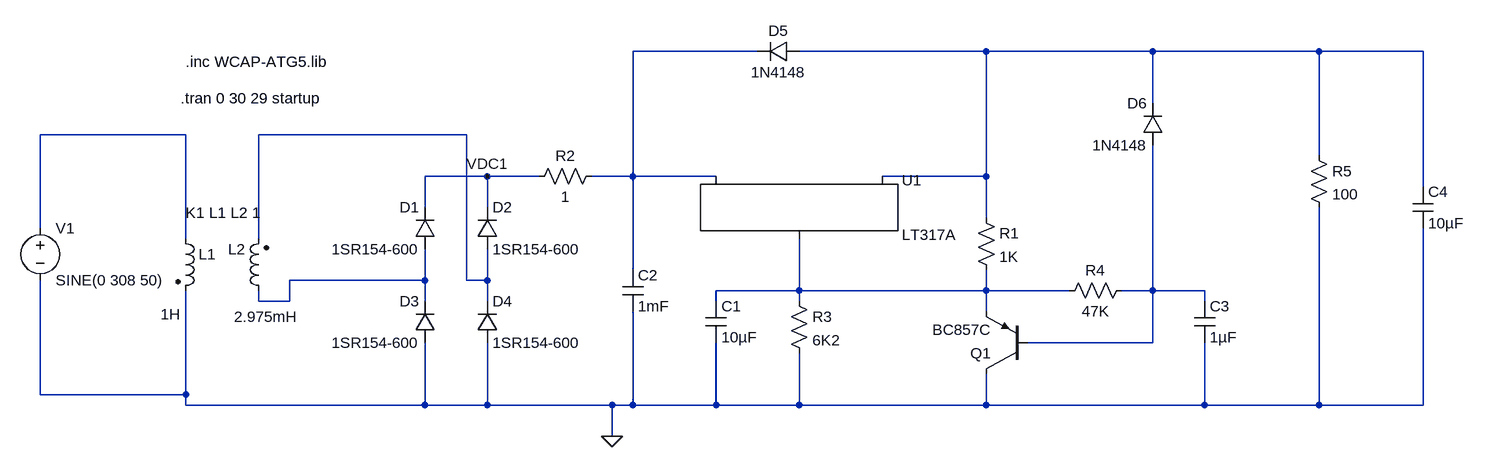
[diagram p0: schematic DC_PSUPPLY.asc]
DC_PSUPPLY.asc, the LTspice schematic file:
Version 4
SHEET 1 2188 680
WIRE 784 -176 592 -176
WIRE 1136 -176 848 -176
WIRE 1392 -176 1136 -176
WIRE 1648 -176 1392 -176
WIRE 1808 -176 1648 -176
WIRE 1392 -96 1392 -176
WIRE -96 -48 -320 -48
WIRE 336 -48 16 -48
WIRE 1648 -16 1648 -176
WIRE 368 16 272 16
WIRE 448 16 368 16
WIRE 592 16 592 -176
WIRE 592 16 528 16
WIRE 720 16 592 16
WIRE 1136 16 1136 -176
WIRE 1136 16 976 16
WIRE 1808 32 1808 -176
WIRE 272 64 272 16
WIRE 368 64 368 16
WIRE 1136 80 1136 16
WIRE -320 96 -320 -48
WIRE -96 112 -96 -48
WIRE 16 112 16 -48
WIRE 592 160 592 16
WIRE 272 176 272 128
WIRE 272 176 64 176
WIRE 336 176 336 -48
WIRE 368 176 368 128
WIRE 368 176 336 176
WIRE 848 192 848 112
WIRE 848 192 720 192
WIRE 1136 192 1136 160
WIRE 1136 192 848 192
WIRE 1264 192 1136 192
WIRE 1392 192 1392 -32
WIRE 1392 192 1344 192
WIRE 1472 192 1392 192
WIRE 16 208 16 192
WIRE 64 208 64 176
WIRE 64 208 16 208
WIRE 272 208 272 176
WIRE 368 208 368 176
WIRE 720 208 720 192
WIRE 848 208 848 192
WIRE 1472 208 1472 192
WIRE 1136 224 1136 192
WIRE 1392 272 1392 192
WIRE 1392 272 1200 272
WIRE -320 352 -320 176
WIRE -96 352 -96 192
WIRE -96 352 -320 352
WIRE -96 368 -96 352
WIRE 272 368 272 272
WIRE 272 368 -96 368
WIRE 368 368 368 272
WIRE 368 368 272 368
WIRE 560 368 368 368
WIRE 592 368 592 224
WIRE 592 368 560 368
WIRE 720 368 720 272
WIRE 720 368 592 368
WIRE 848 368 848 288
WIRE 848 368 720 368
WIRE 1136 368 1136 320
WIRE 1136 368 848 368
WIRE 1472 368 1472 272
WIRE 1472 368 1136 368
WIRE 1648 368 1648 64
WIRE 1648 368 1472 368
WIRE 1808 368 1808 96
WIRE 1808 368 1648 368
WIRE 560 416 560 368
FLAG 560 416 0
FLAG 368 16 VDC1
SYMBOL ind2 -112 96 R0
WINDOW 3 -23 132 Left 2
SYMATTR InstName L1
SYMATTR Value 1H
SYMATTR Type ind
SYMATTR SpiceLine Rser=1
SYMBOL ind2 32 208 R180
WINDOW 0 36 80 Left 2
WINDOW 3 -45 -24 Left 2
SYMATTR InstName L2
SYMATTR Value 2.975mH
SYMATTR Type ind
SYMATTR SpiceLine Rser=1
SYMBOL diode 288 128 R180
WINDOW 0 24 64 Left 2
WINDOW 3 24 0 Left 2
SYMATTR InstName D1
SYMATTR Value 1SR154-600
SYMBOL diode 352 128 M180
WINDOW 0 24 64 Left 2
WINDOW 3 24 0 Left 2
SYMATTR InstName D2
SYMATTR Value 1SR154-600
SYMBOL diode 288 272 R180
WINDOW 0 24 64 Left 2
WINDOW 3 24 0 Left 2
SYMATTR InstName D3
SYMATTR Value 1SR154-600
SYMBOL diode 352 272 M180
WINDOW 0 24 64 Left 2
WINDOW 3 24 0 Left 2
SYMATTR InstName D4
SYMATTR Value 1SR154-600
SYMBOL voltage -320 80 R0
WINDOW 123 0 0 Left 0
WINDOW 39 0 0 Left 0
SYMATTR InstName V1
SYMATTR Value SINE(0 308 50)
SYMBOL res 544 0 R90
WINDOW 0 0 56 VBottom 2
WINDOW 3 32 56 VTop 2
SYMATTR InstName R2
SYMATTR Value 1
SYMBOL cap 576 160 R0
SYMATTR InstName C2
SYMATTR Value 1mF
SYMBOL PowerProducts\\LT317A 848 16 R0
SYMATTR InstName U1
SYMBOL res 1120 64 R0
SYMATTR InstName R1
SYMATTR Value 1K
SYMBOL res 832 192 R0
SYMATTR InstName R3
SYMATTR Value 6K2
SYMBOL cap 704 208 R0
SYMATTR InstName C1
SYMATTR Value 10µF
SYMBOL diode 848 -192 R90
WINDOW 0 0 32 VBottom 2
WINDOW 3 32 32 VTop 2
SYMATTR InstName D5
SYMATTR Value 1N4148
SYMBOL res 1360 176 R90
WINDOW 0 0 56 VBottom 2
WINDOW 3 32 56 VTop 2
SYMATTR InstName R4
SYMATTR Value 47K
SYMBOL diode 1408 -32 R180
WINDOW 0 24 64 Left 2
WINDOW 3 24 0 Left 2
SYMATTR InstName D6
SYMATTR Value 1N4148
SYMBOL pnp 1200 320 R180
SYMATTR InstName Q1
SYMATTR Value BC857C
SYMBOL cap 1456 208 R0
SYMATTR InstName C3
SYMATTR Value 1µF
SYMBOL res 1632 -32 R0
SYMATTR InstName R5
SYMATTR Value 100
SYMBOL cap 1792 32 R0
SYMATTR InstName C4
SYMATTR Value 10µF
TEXT -96 72 Left 2 !K1 L1 L2 1
TEXT -104 -104 Left 2 !.tran 0 30 29 startup
TEXT -96 -160 Left 2 !.inc WCAP-ATG5.lib

The netlist it stands for:
* DC_PSUPPLY.asc
L1 N003 0 1H Rser=1
L2 N005 N004 2.975mH Rser=1
D1 N005 VDC1 1SR154-600
D2 N004 VDC1 1SR154-600
D3 0 N005 1SR154-600
D4 0 N004 1SR154-600
V1 N003 0 SINE(0 308 50)
R2 N001 VDC1 1
C2 N001 0 1mF
XU1 N006 N002 N001 LT317A
R1 N002 N006 1K
R3 N006 0 6K2
C1 N006 0 10µF
D5 N002 N001 1N4148
R4 N007 N006 47K
D6 N007 N002 1N4148
Q1 0 N007 N006 0 BC857C
C3 N007 0 1µF
R5 N002 0 100
C4 N002 0 10µF
.model D D
.lib standard.dio
.model NPN NPN
.model PNP PNP
.lib standard.bjt
K1 L1 L2 1
.tran 0 30 29 startup
.inc WCAP-ATG5.lib
.lib LTC.lib
.backanno
.end